# EAGLE design Combined MXP board (EAGLE 7.1.0)
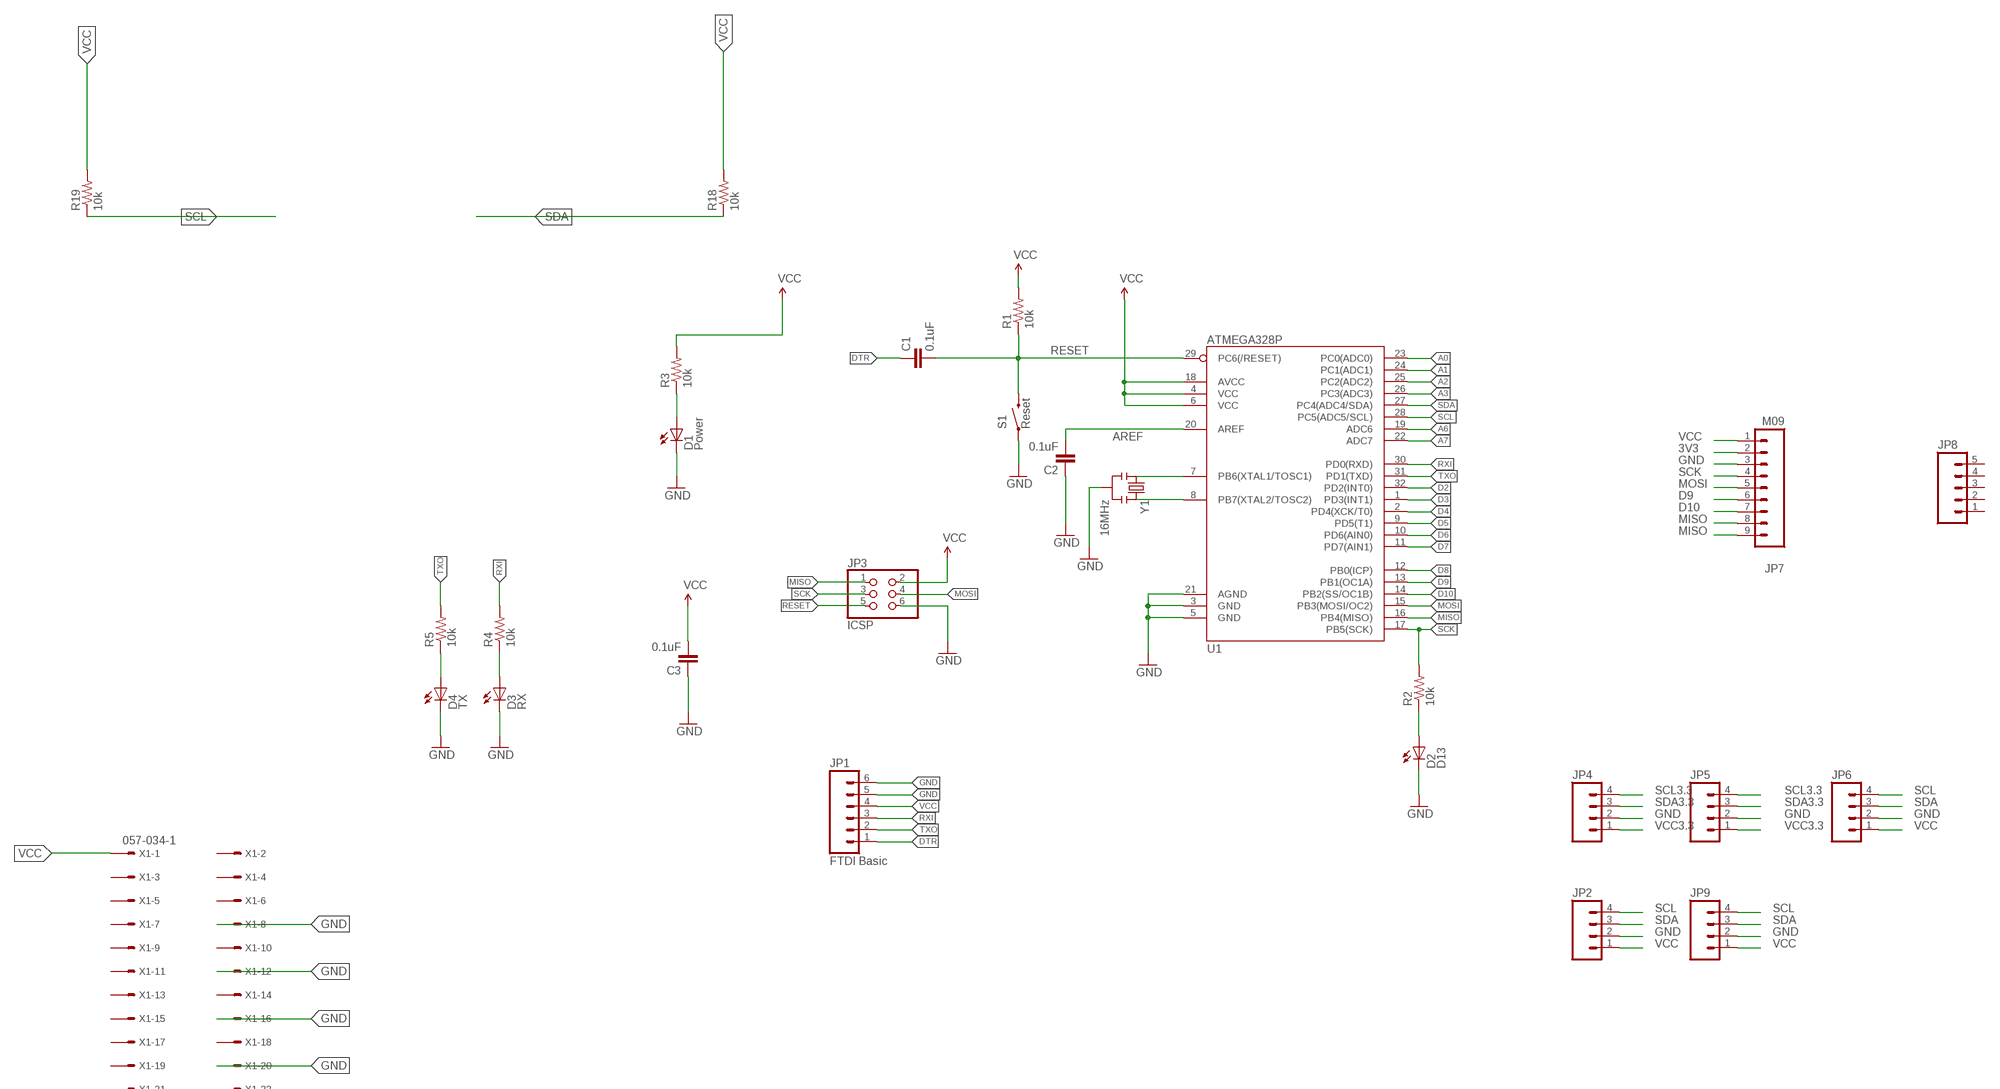
[diagram p0: schematic, sheet 1, part 1 of 2]
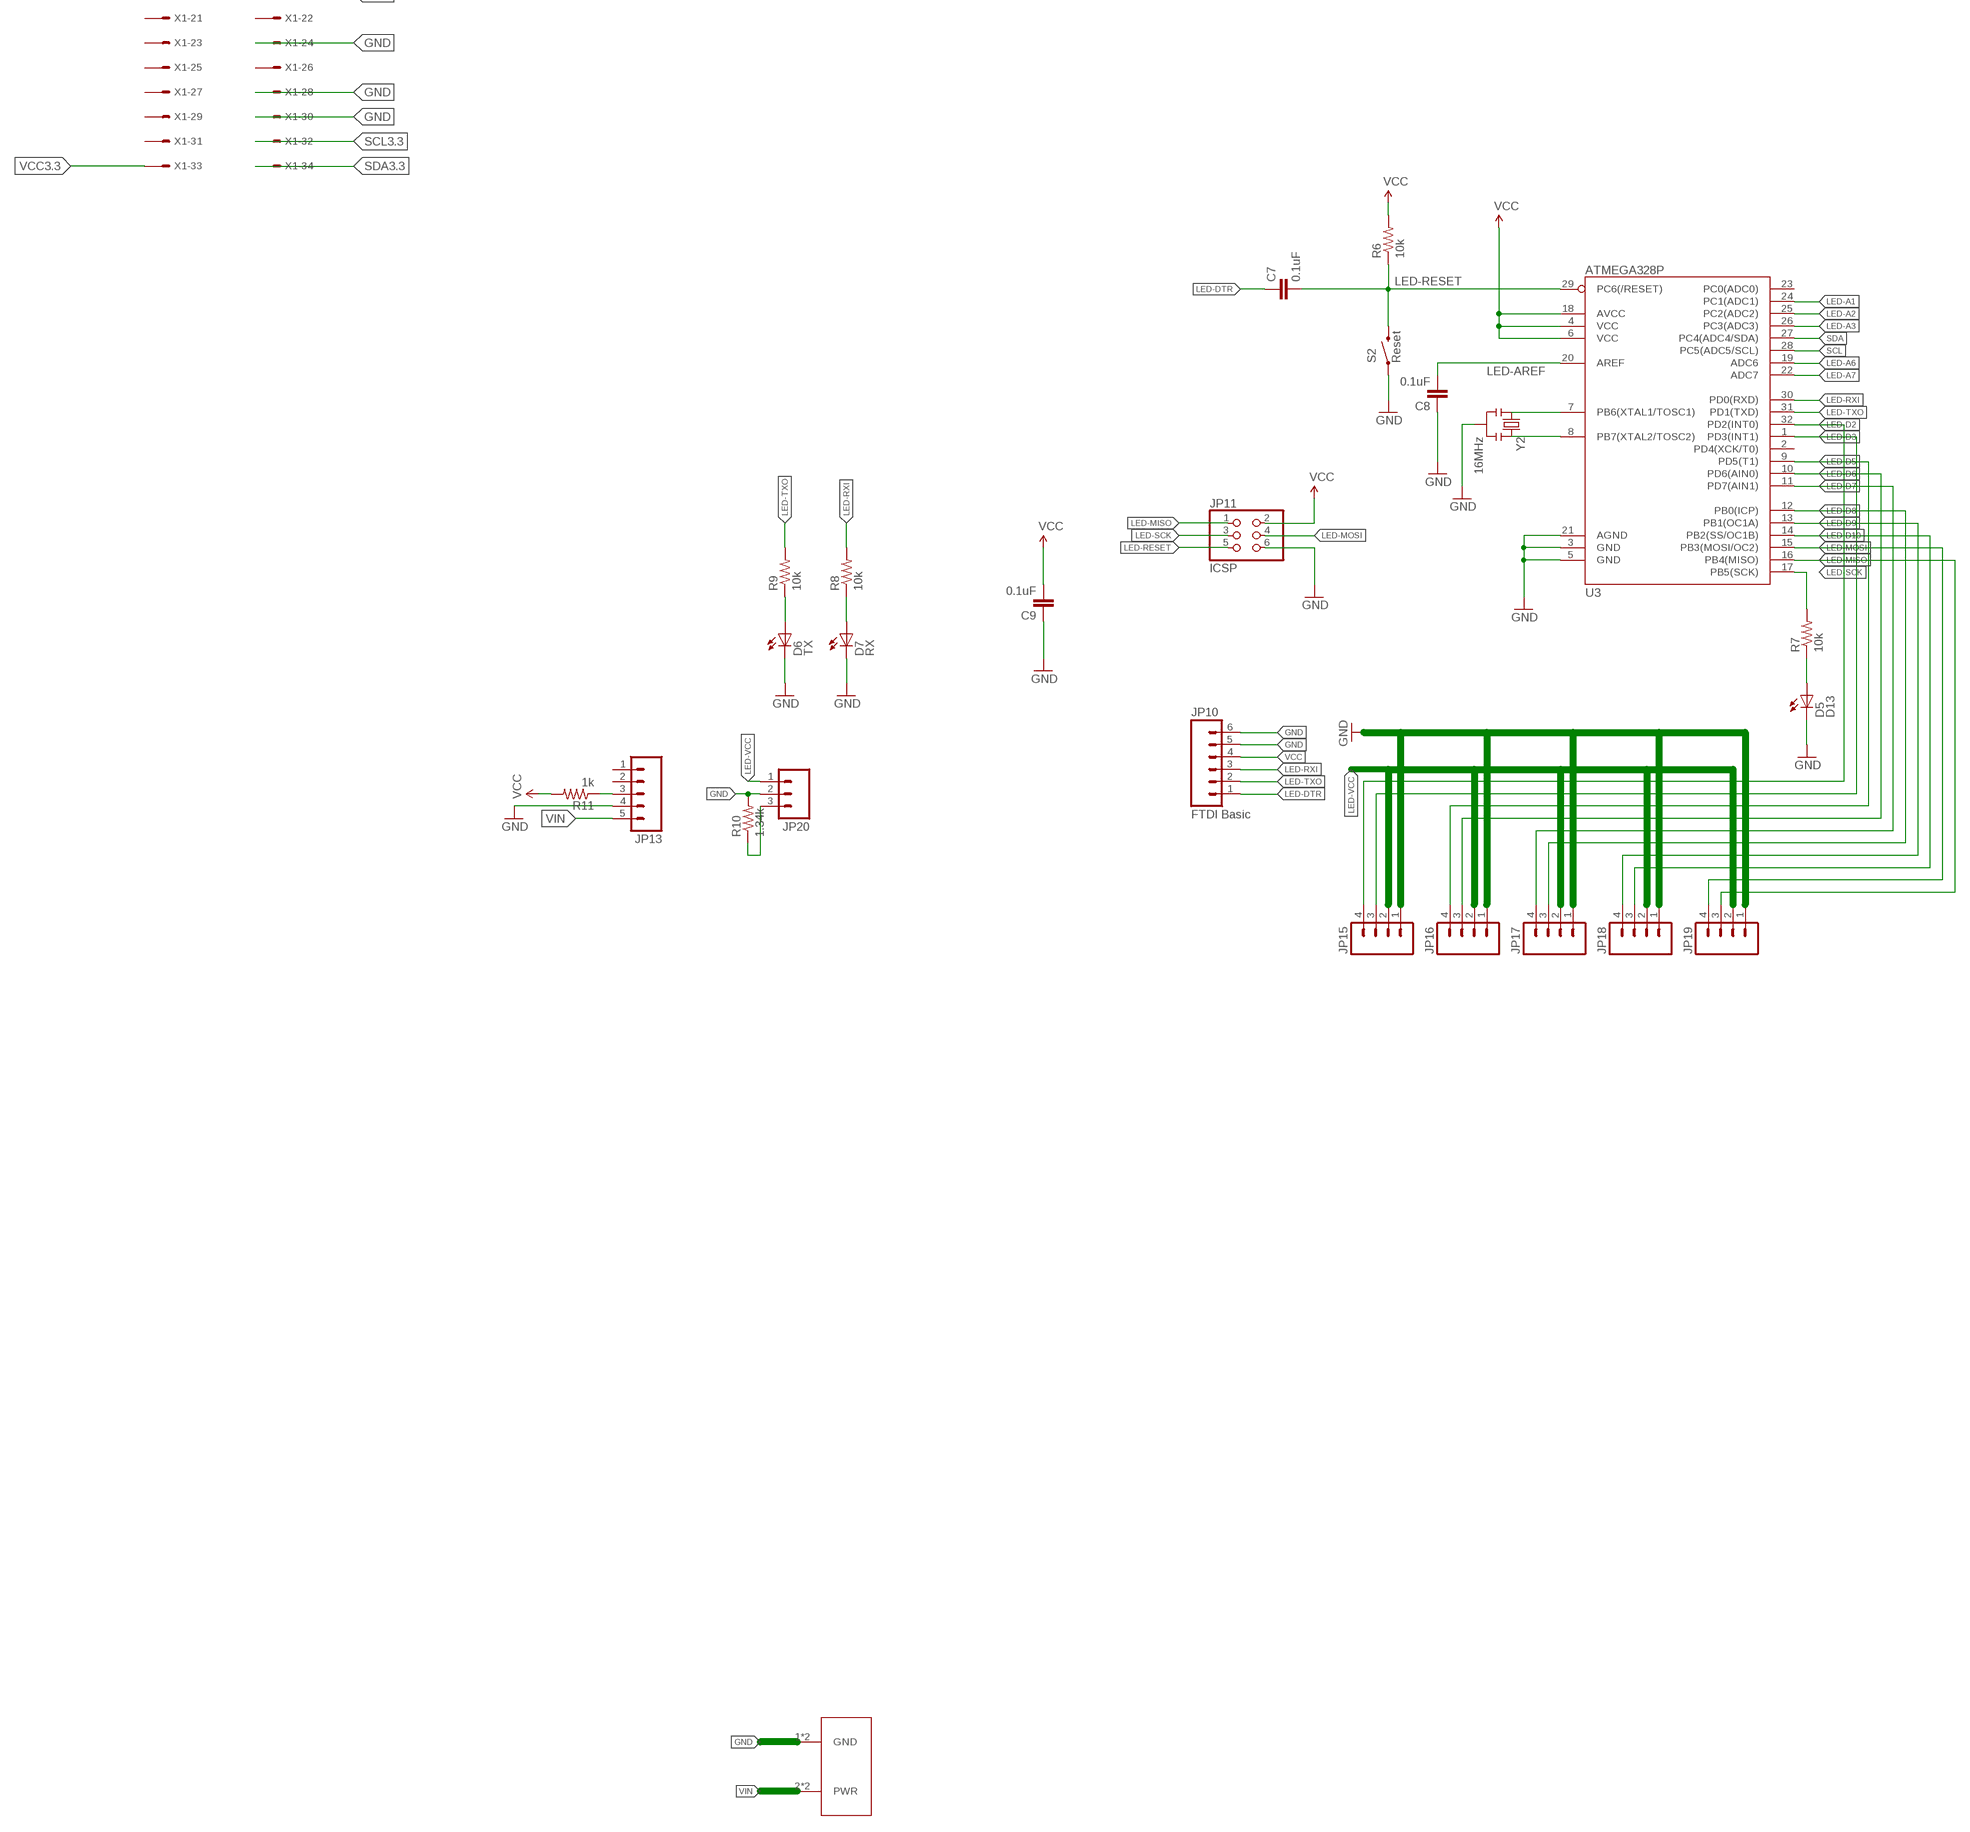
[diagram p1: schematic, sheet 1, part 2 of 2]

## Parts
C1  0.1uF  CAP0603-CAP  [0603-CAP]
C2  0.1uF  CAP0603-CAP  [0603-CAP]
C3  0.1uF  CAP0603-CAP  [0603-CAP]
C7  0.1uF  CAP0603-CAP  [0603-CAP]
C8  0.1uF  CAP0603-CAP  [0603-CAP]
C9  0.1uF  CAP0603-CAP  [0603-CAP]
D1  Power  LED-RED0603  [LED-0603]
D2  D13  LED-RED0603  [LED-0603]
D3  RX  LED-GREEN0603  [LED-0603]
D4  TX  LED-RED0603  [LED-0603]
D5  D13  LED-RED0603  [LED-0603]
D6  TX  LED-RED0603  [LED-0603]
D7  RX  LED-GREEN0603  [LED-0603]
JP1  FTDI Basic  M06SIP  [1X06]
JP2  M04PTH  [1X04]
JP3  ICSP  PINHD-2X3  [2X03]
JP4  M04PTH  [1X04]
JP5  M04PTH  [1X04]
JP6  M04PTH  [1X04]
JP7  M09  [1X09]
JP8  M05PTH  [1X05]
JP9  M04PTH  [1X04]
JP10  FTDI Basic  M06SIP  [1X06]
JP11  ICSP  PINHD-2X3  [2X03]
JP13  M05PTH  [1X05]
JP15  M04PTH  [1X04]
JP16  M04PTH  [1X04]
JP17  M04PTH  [1X04]
JP18  M04PTH  [1X04]
JP19  M04PTH  [1X04]
JP20  M03PTH  [1X03]
R1  10k  RESISTOR0603-RES  [0603-RES]
R2  10k  RESISTOR0603-RES  [0603-RES]
R3  10k  RESISTOR0603-RES  [0603-RES]
R4  10k  RESISTOR0603-RES  [0603-RES]
R5  10k  RESISTOR0603-RES  [0603-RES]
R6  10k  RESISTOR0603-RES  [0603-RES]
R7  10k  RESISTOR0603-RES  [0603-RES]
R8  10k  RESISTOR0603-RES  [0603-RES]
R9  10k  RESISTOR0603-RES  [0603-RES]
R10  1.34k  RESISTORAXIAL-0.3  [AXIAL-0.3]
R11  1k  RESISTORAXIAL-0.3  [AXIAL-0.3]
R18  10k  RESISTOR0603-RES  [0603-RES]
R19  10k  RESISTOR0603-RES  [0603-RES]
S1  Reset  SWITCH-MOMENTARY-2SMD  [TACTILE_SWITCH_SMD]
S2  Reset  SWITCH-MOMENTARY-2SMD  [TACTILE_SWITCH_SMD]
U1  ATMEGA328P  ATMEGA328_SMT  [TQFP32-08]
U3  ATMEGA328P  ATMEGA328_SMT  [TQFP32-08]
U$2  LSF-SMT  [LSF-SMT]
X1  057-034-1  [057-034-1]
Y1  16MHz  RESONATOR16MHZ  [RESONATOR-SMD]
Y2  16MHz  RESONATOR16MHZ  [RESONATOR-SMD]

## Nets
3V3: JP7.2
A0: U1.23(PC0(ADC0))
A1: U1.24(PC1(ADC1))
A2: U1.25(PC2(ADC2))
A3: U1.26(PC3(ADC3))
A6: U1.19(ADC6)
A7: U1.22(ADC7)
AREF: C2.2 U1.20(AREF)
D2: U1.32(PD2(INT0))
D3: U1.1(PD3(INT1))
D4: U1.2(PD4(XCK/T0))
D5: U1.9(PD5(T1))
D6: U1.10(PD6(AIN0))
D7: U1.11(PD7(AIN1))
D8: U1.12(PB0(ICP))
D9: JP7.6 U1.13(PB1(OC1A))
D10: JP7.7 U1.14(PB2(SS/OC1B))
DTR: C1.1 JP1.1
GND: C2.1 C3.1 C8.1 C9.1 D1.C D2.C D3.C D4.C D5.C D6.C D7.C JP1.5 JP1.6 JP2.2 JP3.6 JP4.2 JP5.2 JP6.2 JP7.3 JP9.2 JP10.5 JP10.6 JP11.6 JP13.4 JP15.1 JP16.1 JP17.1 JP18.1 JP19.1 JP20.2 R10.P$2 S1.1 S2.1 U1.3(GND) U1.5(GND) U1.21(AGND) U3.3(GND) U3.5(GND) U3.21(AGND) U$2.1(GND) U$2.1-2(GND) X1.8 X1.12 X1.16 X1.20 X1.24 X1.28 X1.30 Y1.2 Y2.2
LED-A1: U3.24(PC1(ADC1))
LED-A2: U3.25(PC2(ADC2))
LED-A3: U3.26(PC3(ADC3))
LED-A6: U3.19(ADC6)
LED-A7: U3.22(ADC7)
LED-AREF: C8.2 U3.20(AREF)
LED-D2: JP15.4 U3.32(PD2(INT0))
LED-D3: JP15.3 U3.1(PD3(INT1))
LED-D5: JP16.4 U3.9(PD5(T1))
LED-D6: JP16.3 U3.10(PD6(AIN0))
LED-D7: JP17.4 U3.11(PD7(AIN1))
LED-D8: JP17.3 U3.12(PB0(ICP))
LED-D9: JP18.4 U3.13(PB1(OC1A))
LED-D10: JP18.3 U3.14(PB2(SS/OC1B))
LED-DTR: C7.1 JP10.1
LED-MISO: JP11.1 JP19.3 U3.16(PB4(MISO))
LED-MOSI: JP11.4 JP19.4 U3.15(PB3(MOSI/OC2))
LED-RESET: C7.2 JP11.5 R6.1 S2.3 U3.29(PC6(/RESET))
LED-RXI: JP10.3 R8.2 U3.30(PD0(RXD))
LED-SCK: JP11.3 R7.2 U3.17(PB5(SCK))
LED-TXO: JP10.2 R9.2 U3.31(PD1(TXD))
LED-VCC: JP15.2 JP16.2 JP17.2 JP18.2 JP19.2 JP20.1
MISO: JP3.1 JP7.8 JP7.9 U1.16(PB4(MISO))
MOSI: JP3.4 JP7.5 U1.15(PB3(MOSI/OC2))
N$1: U1.7(PB6(XTAL1/TOSC1)) Y1.1
N$2: U1.8(PB7(XTAL2/TOSC2)) Y1.3
N$3: D1.A R3.1
N$4: D2.A R2.1
N$5: D3.A R4.1
N$6: D4.A R5.1
N$7: U3.7(PB6(XTAL1/TOSC1)) Y2.1
N$8: U3.8(PB7(XTAL2/TOSC2)) Y2.3
N$9: D5.A R7.1
N$10: D6.A R9.1
N$11: D7.A R8.1
N$12: JP20.3 R10.P$1
N$14: JP13.3 R11.P$1
RESET: C1.2 JP3.5 R1.1 S1.3 U1.29(PC6(/RESET))
RXI: JP1.3 R4.2 U1.30(PD0(RXD))
SCK: JP3.3 JP7.4 R2.2 U1.17(PB5(SCK))
SCL: JP2.4 JP6.4 JP9.4 R19.1 U1.28(PC5(ADC5/SCL)) U3.28(PC5(ADC5/SCL))
SCL3.3: JP4.4 JP5.4 X1.32
SDA: JP2.3 JP6.3 JP9.3 R18.1 U1.27(PC4(ADC4/SDA)) U3.27(PC4(ADC4/SDA))
SDA3.3: JP4.3 JP5.3 X1.34
TXO: JP1.2 R5.2 U1.31(PD1(TXD))
VCC: C3.2 C9.2 JP1.4 JP2.1 JP3.2 JP6.1 JP7.1 JP9.1 JP10.4 JP11.2 R1.2 R3.2 R6.2 R11.P$2 R18.2 R19.2 U1.4(VCC) U1.6(VCC) U1.18(AVCC) U3.4(VCC) U3.6(VCC) U3.18(AVCC) X1.1
VCC3.3: JP4.1 JP5.1 X1.33
VIN: JP13.5 U$2.2(PWR) U$2.2-2(PWR)
Unconnected: JP8.1 JP8.2 JP8.3 JP8.4 JP8.5 JP13.1 JP13.2 U3.2(PD4(XCK/T0)) U3.23(PC0(ADC0)) X1.2 X1.3 X1.4 X1.5 X1.6 X1.7 X1.9 X1.10 X1.11 X1.13 X1.14 X1.15 X1.17 X1.18 X1.19 X1.21 X1.22 X1.23 X1.25 X1.26 X1.27 X1.29 X1.31

## Library data of the parts
C1-C3 C7-C9 = SparkFun-Passives:CAP: Capacitor Standard 0603 ceramic capacitor, and 0.1" leaded capacitor.
D1 D2 D4-D6 = SparkFun-LED:LED-RED: Assorted Red LEDs LilyPad 1206- DIO-09912 1206- DIO-00809 0603- DIO-00819; PROD_ID: DIO-00819; VALUE: RED
D3 D7 = SparkFun-LED:LED-GREEN: Various green LEDs Green LEDs used in SFE Production 0603- DIO-00821 LARGE- DIO-00862 LILYPAD- DIO-09910; PROD_ID: DIO-00821; VALUE: GREEN
JP1 JP10 = SparkFun-Connectors:M06: Header 6 Standard 6-pin 0.1" header. Use with straight break away headers (SKU : PRT-00116), right angle break away headers (PRT-00553), swiss pins (PRT-00743), machine pins (PRT-00117), and female headers (PRT-00115). Molex polarized connector foot print use with SKU : PRT-08094 with associated crimp pins and housings. NOTES ON THE VARIANTS LOCK and LOCK_LONGPADS... This footprint was designed to help hold the alignment of a through-hole component (i.e. 6-pin header) while soldering it into place. You may notice that each hole has been shifted either up or down by 0.005 of an inch from it's more standard position (which is a perfectly straight line). This slight alteration caused the pins (the squares in the middle) to touch the edges of the holes. Because they are alternating, it causes a "brace" to hold the component in place. 0.005 has proven to be the perfect amount of "off-center" position when using our standard breakaway headers. Although looks a little odd when you look at the bare footprint, once you have a header in there, the alteration is very hard to notice. Also,if you push a header all the way into place, it is covered up entirely on the bottom side. This idea of altering the position of holes to aid alignment will be further integrated into the Sparkfun Library for other footprints. It can help hold any component with 3 or more connection pins.
JP2 JP4-JP6 JP9 JP15-JP19 = SparkFun-Connectors:M04: Header 4 Standard 4-pin 0.1" header. Use with straight break away headers (SKU : PRT-00116), right angle break away headers (PRT-00553), swiss pins (PRT-00743), machine pins (PRT-00117), and female headers (PRT-00115). Molex polarized connector foot print use with SKU : PRT-08231 with associated crimp pins and housings. 1MM SMD Version SKU: PRT-10208
JP3 JP11 = SparkFun-Connectors:PINHD-2X3: PIN HEADER
JP7 = SparkFun-Connectors:M09: Header 9 Standard 9-pin 0.1" header. Use with straight break away headers (SKU : PRT-00116), right angle break away headers (PRT-00553), swiss pins (PRT-00743), machine pins (PRT-00117), and female headers (PRT-00115).
JP8 JP13 = SparkFun-Connectors:M05: Header 5 Standard 5-pin 0.1" header. Use with straight break away headers (SKU : PRT-00116), right angle break away headers (PRT-00553), swiss pins (PRT-00743), machine pins (PRT-00117), and female headers (PRT-00115). Molex polarized connector foot print use with SKU : PRT-08230 with associated crimp pins and housings.
JP20 = SparkFun-Connectors:M03: Header 3 Standard 3-pin 0.1" header. Use with straight break away headers (SKU : PRT-00116), right angle break away headers (PRT-00553), swiss pins (PRT-00743), machine pins (PRT-00117), and female headers (PRT-00115). Molex polarized connector foot print use with SKU : PRT-08232 with associated crimp pins and housings.
R1-R9 R18 R19 = SparkFun-Passives:RESISTOR: Resistor Basic schematic elements and footprints for 0603, 1206, and PTH resistors.
R10 R11 = SparkFun-Resistors:RESISTOR: Resistor Basic schematic elements and footprints for 0603, 1206, and PTH resistors.
S1 S2 = SparkFun-Electromechanical:SWITCH-MOMENTARY-2: Various NO switches- pushbuttons, reed, etc; PROD_ID: SWCH-08247
U1 U3 = SparkFun-DigitalIC:ATMEGA328_SMT: 32-Pin Atmega328 part Commonly used on Arduino compatible boards Available in QFP and QFN packages TQFP is IC-09069 QFN is non-stock; PROD_ID: IC-09069
U$2 = LSF-SMT:LSF-SMT
X1 = con-panduit:057-034-: CONNECTOR 34-pin series 057 contact pc board low profile headers; OC_FARNELL: unknown; OC_NEWARK: unknown
Y1 Y2 = SparkFun-FreqCtrl:RESONATOR: Resonator Small SMD resonator. Used, eg, on the Arduino Pro/ Pro Mini boards. 8MHz- XTAL-08895 16MHz- XTAL-08900; PROD_ID: XTAL-08900

## Board
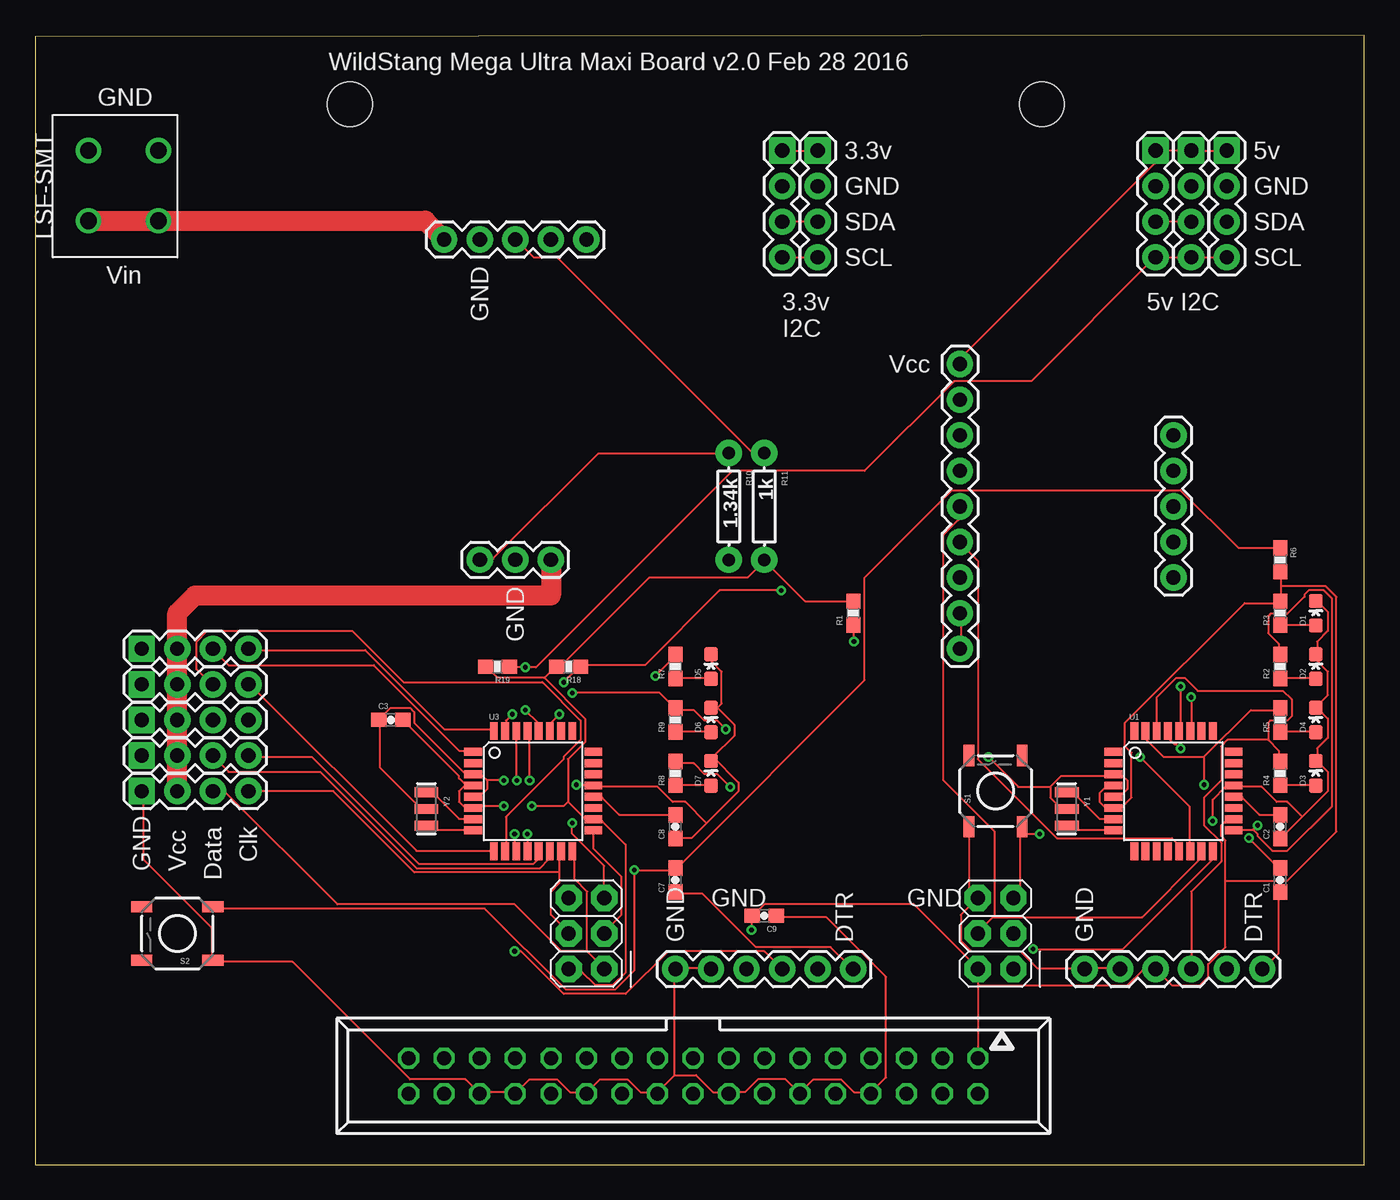
[diagram p2: board, top side]
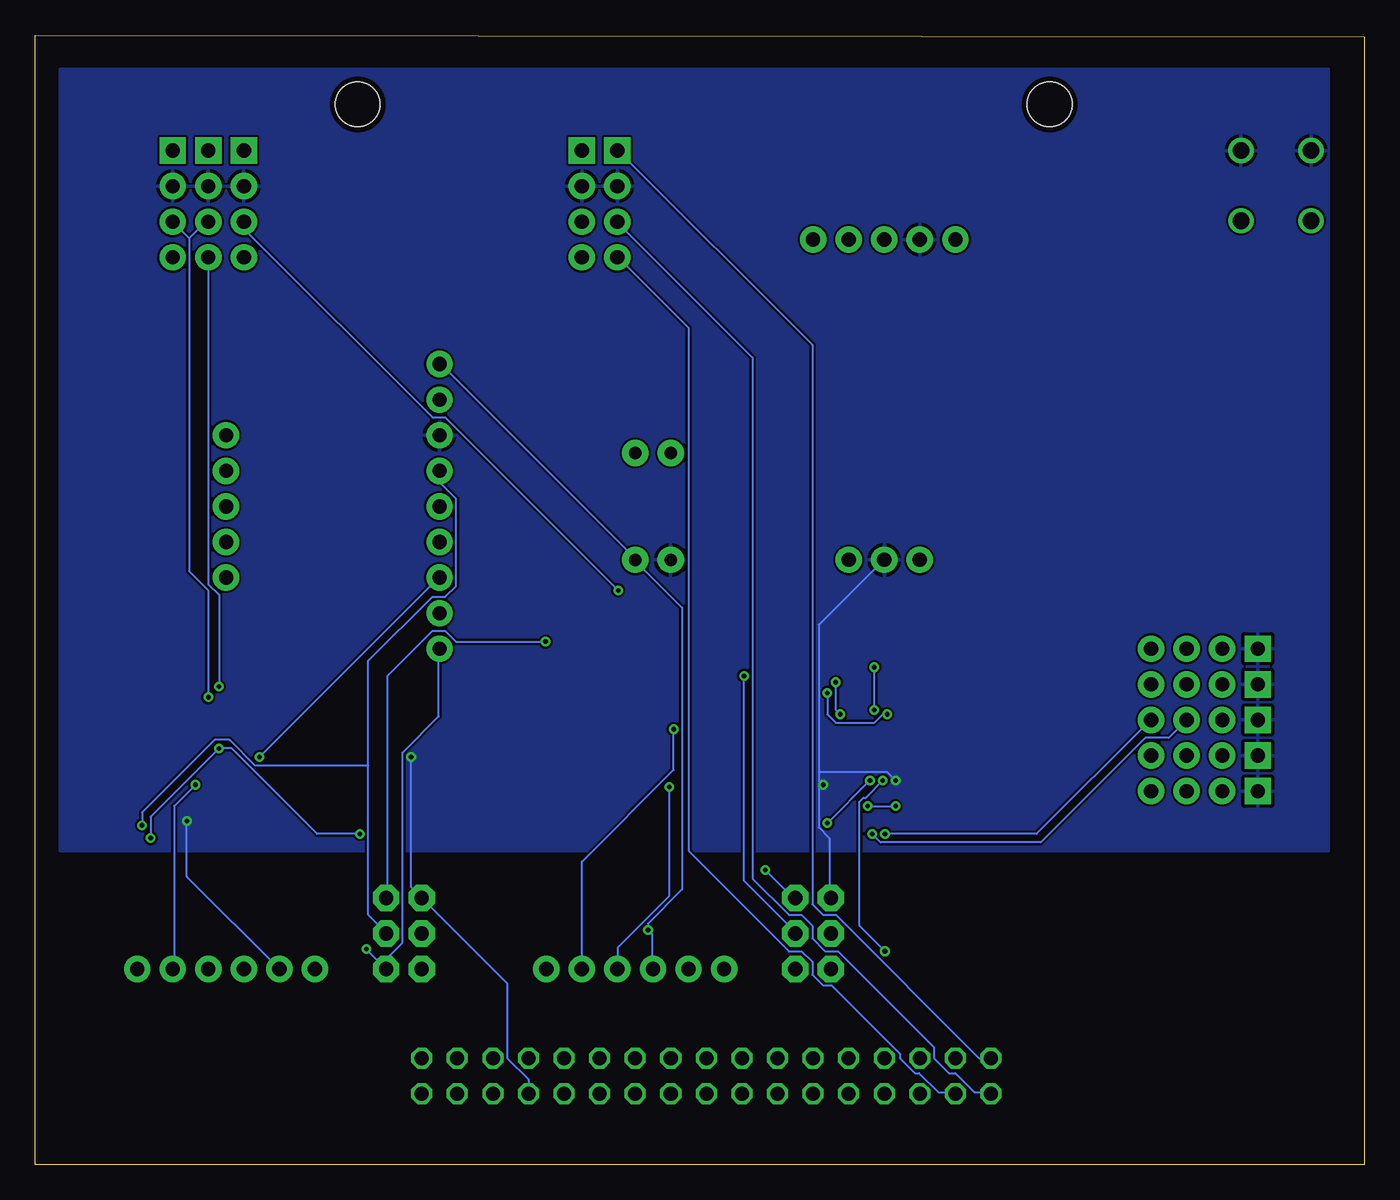
[diagram p3: board, bottom side, seen from below]

Size 94.92 x 80.64 mm. Coordinates in mm from the lower left corner, seen from the top.
Outline: 0,0 94.92,0 94.92,80.64 0,80.51 0,0
Copper layers (1*16): Top 0.0356mm / dielectric 1.5011mm / Bottom 0.0356mm
Design rules "LaenPCBOrder": minimum track width 6mil, minimum drill 13mil, track to track 6mil, track to pad 6mil, pad to pad 6mil, via to via 6mil, smd to smd 6mil, copper to edge 15mil, drill to drill 6mil, minimum pad ring 7mil, minimum via ring 7mil, stop-mask expansion 3mil, vias tented up to drill 0mil, thermal gap 10mil
Holes 3.2 mm at 22.48,75.69 71.88,75.69

### Footprints (pad centres in the part's own frame; a part is rotated, then mirrored left to right if it is on the bottom)
0603-CAP = smd 1.1 x 1: 1 -0.85,0; 2 0.85,0
LED-0603 = smd 1 x 1: A 0,-0.877; C 0,0.877
1X06 = drill 1.016 pad 1.88: 1 0,0; 2 2.54,0; 3 5.08,0; 4 7.62,0; 5 10.16,0; 6 12.7,0
1X04 = drill 1.016 pad 1.88 square: 1 0,0 | drill 1.016 pad 1.88: 2 2.54,0; 3 5.08,0; 4 7.62,0
2X03 = drill 1.016 pad 1.88 octagon: 1 -2.54,-1.27; 2 -2.54,1.27; 3 0,-1.27; 4 0,1.27; 5 2.54,-1.27; 6 2.54,1.27
1X09 = drill 1.016 pad 1.88: 1 0,0; 2 2.54,0; 3 5.08,0; 4 7.62,0; 5 10.16,0; 6 12.7,0; 7 15.24,0; 8 17.78,0; 9 20.32,0
1X05 = drill 1.016 pad 1.88: 1 0,0; 2 2.54,0; 3 5.08,0; 4 7.62,0; 5 10.16,0
1X03 = drill 1.016 pad 1.88: 1 0,0; 2 2.54,0; 3 5.08,0
0603-RES = smd 1.1 x 1: 1 -0.85,0; 2 0.85,0
AXIAL-0.3 = drill 0.9 pad 1.88: P$1 -3.81,0; P$2 3.81,0
TACTILE_SWITCH_SMD = smd 1.524 x 0.762: 1 -2.54,1.905; 2 2.54,1.905; 3 -2.54,-1.905; 4 2.54,-1.905
TQFP32-08 = smd 1.27 x 0.559: 1 -4.293,2.8; 2 -4.293,2; 3 -4.293,1.2; 4 -4.293,0.4; 5 -4.293,-0.4; 6 -4.293,-1.2; 7 -4.293,-2; 8 -4.293,-2.8; 17 4.293,-2.8; 18 4.293,-2; 19 4.293,-1.2; 20 4.293,-0.4; 21 4.293,0.4; 22 4.293,1.2; 23 4.293,2; 24 4.293,2.8 | smd 0.559 x 1.27: 9 -2.8,-4.293; 10 -2,-4.293; 11 -1.2,-4.293; 12 -0.4,-4.293; 13 0.4,-4.293; 14 1.2,-4.293; 15 2,-4.293; 16 2.8,-4.293; 25 2.8,4.293; 26 2,4.293; 27 1.2,4.293; 28 0.4,4.293; 29 -0.4,4.293; 30 -1.2,4.293; 31 -2,4.293; 32 -2.8,4.293
LSF-SMT = drill 1.199: 1 0,5.004; 1-2 0,0; 2 5.004,5.004; 2-2 5.004,0
057-034-1 = drill 1 octagon: 1 -20.32,-1.27; 2 -20.32,1.27; 3 -17.78,-1.27; 4 -17.78,1.27; 5 -15.24,-1.27; 6 -15.24,1.27; 7 -12.7,-1.27; 8 -12.7,1.27; 9 -10.16,-1.27; 10 -10.16,1.27; 11 -7.62,-1.27; 12 -7.62,1.27; 13 -5.08,-1.27; 14 -5.08,1.27; 15 -2.54,-1.27; 16 -2.54,1.27; 17 0,-1.27; 18 0,1.27; 19 2.54,-1.27; 20 2.54,1.27; 21 5.08,-1.27; 22 5.08,1.27; 23 7.62,-1.27; 24 7.62,1.27; 25 10.16,-1.27; 26 10.16,1.27; 27 12.7,-1.27; 28 12.7,1.27; 29 15.24,-1.27; 30 15.24,1.27; 31 17.78,-1.27; 32 17.78,1.27; 33 20.32,-1.27; 34 20.32,1.27
RESONATOR-SMD = smd 0.7 x 1.7: 1 -1.2,0; 2 0,0; 3 1.2,0

### Placement (x,y rotation side)
C1  88.9,20.32 90 top
C2  88.9,24.13 90 top
C3  25.4,31.75 0 top
C7  45.72,20.32 90 top
C8  45.72,24.13 90 top
C9  52.07,17.78 180 top
D1  91.44,39.37 0 top
D2  91.44,35.56 0 top
D3  91.44,27.94 0 top
D4  91.44,31.75 0 top
D5  48.26,35.56 0 top
D6  48.26,31.75 0 top
D7  48.26,27.94 0 top
JP1  87.63,13.97 180 top
JP2  80.01,72.39 270 top
JP3  68.58,16.51 90 top
JP4  55.88,72.39 270 top
JP5  53.34,72.39 270 top
JP6  85.09,72.39 270 top
JP7  66.04,57.15 270 top
JP8  81.28,52.07 270 top
JP9  82.55,72.39 270 top
JP10  58.42,13.97 180 top
JP11  39.37,16.51 90 top
JP13  39.37,66.04 180 top
JP15  7.62,36.83 0 top
JP16  7.62,34.29 0 top
JP17  7.62,31.75 0 top
JP18  7.62,29.21 0 top
JP19  7.62,26.67 0 top
JP20  36.83,43.18 180 top
R1  58.42,39.37 90 top
R2  88.9,35.56 90 top
R3  88.9,39.37 90 top
R4  88.9,27.94 90 top
R5  88.9,31.75 90 top
R6  88.9,43.18 270 top
R7  45.72,35.56 90 top
R8  45.72,27.94 90 top
R9  45.72,31.75 90 top
R10  49.53,46.99 270 top
R11  52.07,46.99 270 top
R18  38.1,35.56 180 top
R19  33.02,35.56 180 top
S1  68.58,26.67 90 top
S2  10.16,16.51 180 top
U1  81.28,26.67 0 top
U3  35.56,26.67 0 top
U$2  3.81,72.39 270 top
X1  46.99,6.35 180 top
Y1  73.66,25.4 270 top
Y2  27.94,25.4 270 top

### Tracks (layer width: path | path; a pad name or v marks a point on that pad's centre or on a via)
AREF
  Top 0.152: C2.2 88.8,24.99 87.43,24.99 86.21,26.21 85.6,26.21 U1.20
D9
  Top 0.152: U1.13 81.64,22.4 81.64,22.86 81.18,23.32 72.95,23.32 67.31,28.96 67.31,43.13 66.09,44.35 JP7.6
D10  (via drill 0.33)
  Top 0.152: v78.89,29.11 82.4,25.6 82.4,22.4 U1.14
  Bottom 0.152: v78.89,29.11 66.09,41.91 JP7.7
DTR
  Top 0.152: C1.1 88.8,19.36 88.8,15.09 87.73,14.02 JP1.1
GND  (via drill 0.33)
  Top 0.152: 48.41,29.11 49.94,30.63 49.94,31.39 48.72,32.61 | 48.41,29.11 48.26,28.96 D7.C 48.41,29.11 | 48.72,32.61 48.26,32.61 D6.C 48.72,32.61 | D5.C 48.26,35.97 49.02,35.2 49.02,32.92 48.72,32.61 | 47.95,24.38 50.24,26.67 50.24,27.28 48.41,29.11 | 47.95,24.38 46.89,23.32 45.82,23.32 C8.1 | 47.95,24.38 46.43,25.91 45.52,25.91 44.45,26.98 39.88,26.98 U3.21 39.73,27.13 v38.66,27.13 | 32.26,27.43 32.26,26.82 31.8,26.36 31.34,26.36 U3.5 | 32.26,27.43 31.95,27.74 31.34,27.74 U3.3 31.19,27.89 30.73,27.89 27.08,31.55 27.08,32.31 26.77,32.61 25.4,32.61 24.64,31.85 C3.1 24.64,31.7 24.64,28.35 27.53,25.45 27.84,25.45 Y2.2 | JP19.1 7.72,26.67 7.72,21.79 12.6,16.92 12.6,14.63 S2.1 12.75,14.48 18.39,14.48 26.77,6.1 30.73,6.1 X1.30 31.8,5.18 34.24,5.18 X1.28 35.31,6.1 37.29,6.1 38.2,5.18 39.27,5.18 X1.24 39.42,5.18 40.34,6.1 42.32,6.1 43.23,5.18 44.45,5.18 | v33.48,27.43 32.26,27.43 | 59.69,5.18 60.76,6.25 60.76,13.41 56.49,17.68 52.98,17.68 C9.1 | JP10.5 48.26,14.02 45.82,14.02 JP10.6 45.67,13.87 45.67,6.4 | 44.45,5.18 45.67,6.4 | 44.45,5.18 X1.20 | 45.67,6.4 47.19,6.4 48.41,5.18 49.48,5.18 X1.16 49.63,5.18 50.7,5.18 51.61,6.1 53.59,6.1 X1.12 54.66,5.18 55.58,6.1 57.56,6.1 58.47,5.18 59.69,5.18 | 59.69,5.18 X1.8 | D1.C 91.54,40.23 92.3,39.47 92.3,38.1 91.54,37.34 91.54,36.58 D2.C 91.54,36.42 91.54,35.97 92.3,35.2 92.3,33.53 91.54,32.77 D4.C 91.54,32.61 92.3,31.85 92.3,30.48 91.54,29.72 91.54,28.96 D3.C 91.54,28.8 92.3,28.04 92.3,26.67 90.48,24.84 | 90.48,24.84 88.95,23.32 C2.1 | 90.48,24.84 89.41,25.91 88.65,25.91 87.58,26.98 85.6,26.98 U1.21 85.45,26.98 84.99,26.98 84.07,26.06 v84.07,24.54
  Top 0.152: 74.93,14.02 77.37,14.02 JP1.5 | U1.5 77.06,26.36 77.52,26.36 77.98,26.82 77.98,27.43 77.67,27.74 77.06,27.74 U1.3 76.91,27.74 73.25,27.74 72.49,26.98 | 72.49,26.98 72.49,26.21 73.25,25.45 73.56,25.45 Y1.2 | S1.1 66.7,24.08 66.7,19.66 JP3.6 66.09,17.83 66.09,16 66.85,15.24 70.36,15.24 71.58,14.02 74.93,14.02 | 72.49,26.98 70.21,26.98 v68.07,29.11 | 74.93,14.02 JP1.6
  Bottom 0.152: 38.96,28.04 38.96,38.56 34.39,43.13 JP20.2 | 38.96,28.04 38.96,27.13 | 38.96,27.13 38.96,24.08 38.2,23.32 38.2,19.05 JP11.6 | v33.48,27.43 34.09,28.04 38.96,28.04 | 38.96,27.13 v38.66,27.13 | v68.07,29.11 68.07,19.81 JP3.6 61.21,12.95 61.21,7.62 59.69,6.1 X1.8 | v84.07,24.54 84.07,20.57 JP1.5
  pour Bottom: 2.59,78.18 93.12,78.18 93.12,22.4 2.59,22.4
LED-AREF
  Top 0.152: C8.2 45.67,24.99 41.71,24.99 40.49,26.21 39.88,26.21 U3.20
LED-D2
  Top 0.152: U3.32 32.72,31.09 29.21,31.09 23.57,36.73 15.34,36.73 JP15.4
LED-D3
  Top 0.152: U3.1 31.19,29.57 30.28,29.57 24.18,35.66 13.82,35.66 12.75,36.73 JP15.3
LED-D5
  Top 0.152: U3.9 32.72,22.4 27.23,22.4 15.34,34.29 JP16.4
LED-D6
  Top 0.152: U3.10 33.63,22.4 33.63,24.84 37.74,28.96 37.74,29.11 38.96,30.33 38.96,31.7 36.22,34.44 26.31,34.44 22.66,38.1 12.29,38.1 11.53,37.34 11.53,35.36 12.6,34.29 JP16.3
LED-D7  (via drill 0.33)
  Top 0.152: v34.24,23.62 34.24,22.4 U3.11
  Bottom 0.152: v34.24,23.62 23.42,23.62 15.34,31.7 JP17.4
LED-D8  (via drill 0.33)
  Top 0.152: v35.15,23.62 35.15,22.4 U3.12
  Bottom 0.152: v35.15,23.62 34.54,23.01 23.11,23.01 15.65,30.48 13.97,30.48 JP17.3
LED-D9
  Top 0.152: U3.13 35.92,22.25 35.92,21.79 35.61,21.49 27.38,21.49 19.76,29.11 15.34,29.11 JP18.4
LED-D10
  Top 0.152: U3.14 36.68,22.25 36.68,21.79 36.07,21.18 27.23,21.18 20.37,28.04 13.82,28.04 12.75,29.11 JP18.3
LED-DTR
  Top 0.152: C7.1 45.82,19.36 47.65,19.36 51.46,15.54 56.79,15.54 58.32,14.02 JP10.1
LED-MISO
  Top 0.152: 39.42,15.24 39.42,19.51 38.51,20.42 38.51,22.25 U3.16 | 39.42,15.24 40.64,14.02 JP11.1 | JP19.3 13.51,26.67 21.59,18.59 34.24,18.59 37.59,15.24 39.42,15.24
LED-MOSI
  Top 0.152: 37.44,20.88 37.44,20.12 36.83,19.51 36.83,17.83 38.05,16.61 JP11.4 | 37.44,20.88 37.44,22.25 U3.15 | JP19.4 21.28,26.67 27.08,20.88 37.44,20.88
LED-RESET  (via drill 0.33)
  Top 0.152: R6.1 88.8,44.04 85.9,44.04 81.79,48.16 65.48,48.16 59.23,41.91 59.23,34.59 45.82,21.18 C7.2 45.67,21.03 v42.77,21.03 42.77,13.87 41.4,12.5 37.9,12.5 32.11,18.29 12.75,18.29 S2.3 | v35.31,27.43 35.31,30.94 U3.29 | v38.35,24.38 38.35,23.62 40.64,21.34 JP11.5
  Bottom 0.152: v42.77,21.03 40.79,19.05 JP11.5 | v38.35,24.38 v35.31,27.43
LED-RXI  (via drill 0.33)
  Top 0.152: v49.63,26.98 48.72,27.89 47.8,27.89 47.04,28.65 45.82,28.65 R8.2 | v34.39,27.43 34.39,30.94 U3.30 | v34.24,15.24 34.7,15.24 37.74,12.19 42.16,12.19 45.21,15.24 52.07,15.24 JP10.3
  Bottom 0.152: v49.63,26.98 49.63,19.2 53.29,15.54 53.29,14.02 JP10.3 | v34.39,27.43 35.61,26.21 35.76,26.21 36.07,25.91 36.07,17.07 v34.24,15.24
LED-SCK  (via drill 0.33)
  Top 0.152: v44.3,34.9 45.67,36.27 R7.2 | U3.17 39.88,23.77 39.88,22.55 41.86,20.57 41.86,17.83 40.64,16.61 JP11.3
  Bottom 0.152: v44.3,34.9 44.3,20.27 40.64,16.61 JP11.3
LED-TXO  (via drill 0.33)
  Top 0.152: v49.33,31.09 48.72,31.7 47.8,31.7 47.04,32.46 45.82,32.46 R9.2 45.67,32.61 44.6,33.68 v38.35,33.68 | v34.09,32.16 33.63,31.7 33.63,31.09 U3.31
  Bottom 0.152: v49.33,31.09 49.33,28.19 55.88,21.64 JP10.2 | v34.09,32.16 34.39,32.16 35,31.55 37.74,31.55 38.35,32.16 v38.35,33.68
LED-VCC
  Top 1.422: JP19.2 JP18.2 10.16,29.26 JP17.2 10.16,31.85 JP16.2 JP15.2 10.16,39.37 11.43,40.64 36.83,40.64 JP20.1
MISO  (via drill 0.33)
  Top 0.152: JP7.9 66.09,36.88 66.09,39.32 JP7.8 | v71.27,15.39 77.67,15.39 84.07,21.79 84.07,22.25 U1.16
  Bottom 0.152: 70.21,14.33 JP3.1 69.9,14.02 | 70.21,14.33 v71.27,15.39 | 70.21,14.33 68.68,15.85 68.68,29.41 66.09,32 66.09,36.73 JP7.9
MOSI
  Top 0.152: 68.53,17.68 68.38,17.68 67.31,16.61 JP3.4 | 68.53,17.68 79.05,17.68 83.16,21.79 83.16,22.25 U1.15 | 68.53,17.68 68.53,23.77 64.87,27.43 64.87,44.96 65.94,46.02 65.94,46.94 JP7.5
N$1
  Top 0.152: U1.7 76.91,24.69 76,24.69 74.17,26.52 73.71,26.52 Y1.1
N$2
  Top 0.152: U1.8 76.91,23.93 73.86,23.93 73.71,24.08 Y1.3
N$3
  Top 0.152: D1.A 91.39,38.56 88.95,38.56 R3.1
N$4
  Top 0.152: D2.A 91.39,34.75 88.95,34.75 R2.1
N$5
  Top 0.152: D3.A 91.39,27.13 88.95,27.13 R4.1
N$6
  Top 0.152: D4.A 91.39,30.94 88.95,30.94 R5.1
N$7
  Top 0.152: U3.7 31.19,24.69 30.28,24.69 28.45,26.52 27.99,26.52 Y2.1
N$8
  Top 0.152: U3.8 31.19,23.93 28.14,23.93 27.99,24.08 Y2.3
N$9
  Top 0.152: D5.A 48.26,34.75 45.82,34.75 R7.1
N$10
  Top 0.152: D6.A 48.26,30.94 45.82,30.94 R9.1
N$11
  Top 0.152: D7.A 48.26,27.13 45.82,27.13 R8.1
N$12
  Top 0.152: JP20.3 31.8,43.28 32.72,43.28 40.18,50.75 49.48,50.75 R10.P$1
N$14
  Top 0.152: R11.P$1 52.07,50.9 51.16,50.9 37.29,64.77 35.61,64.77 34.39,65.99 JP13.3
RESET  (via drill 0.33)
  Top 0.152: v86.67,23.32 88.8,21.18 C1.2 | v81.79,29.72 81.48,30.02 81.33,30.02 81.03,30.33 81.03,30.94 U1.29 | v58.47,37.34 58.47,38.41 R1.1 | 70.36,23.62 70.36,19.51 69.9,19.05 JP3.5 | 70.36,23.62 70.36,24.08 S1.3 70.36,23.62 | 70.36,23.62 v71.73,23.62
  Bottom 0.152: v86.67,23.32 86.67,24.84 v81.79,29.72 80.87,29.72 74.78,23.62 v71.73,23.62 | v58.47,37.34 64.87,37.34 65.63,38.1 66.55,38.1 69.75,34.9 69.75,19.05 JP3.5
RXI
  Top 0.152: 88.04,30.33 88.8,29.57 88.8,28.8 R4.2 | 88.04,30.33 88.04,31.55 88.19,31.7 89.41,31.7 89.71,32 89.71,33.22 89.1,33.83 83.01,33.83 82.09,34.75 81.48,34.75 80.11,33.38 80.11,31.09 U1.30 | JP1.3 82.55,19.51 84.68,21.64 84.68,23.01 83.46,24.23 83.46,26.21 84.68,27.43 84.68,29.87 85.14,30.33 88.04,30.33
SCK  (via drill 0.33)
  Top 0.152: 86.97,23.93 87.27,23.62 87.27,23.47 88.34,22.4 89.41,22.4 92.61,25.6 92.61,40.39 92,41 90.93,41 90.63,40.69 90.63,40.54 89.41,39.32 88.19,39.32 88.04,39.17 88.04,37.95 88.8,37.19 88.8,36.42 R2.2 | 86.97,23.93 85.6,23.93 U1.17 | v87.27,24.23 86.97,23.93
  Bottom 0.152: 71.12,28.5 71.12,17.83 69.9,16.61 JP3.3 | 71.12,28.5 71.12,35.97 66.55,40.54 65.63,40.54 64.87,41.3 64.87,47.55 65.94,48.62 65.94,49.53 JP7.4 | v87.27,24.23 87.27,25.15 82.09,30.33 81.03,30.33 79.2,28.5 71.12,28.5
SCL  (via drill 0.33)
  Top 0.152: v81.79,34.14 81.79,31.09 U1.28 | JP6.4 JP9.4 JP2.4 79.96,64.77 71.12,55.93 65.63,55.93 59.23,49.53 49.78,49.53 35.76,35.51 v35,35.51 33.93,35.51 R19.1 | v35,32.46 35.92,31.55 35.92,31.09 U3.28
  Bottom 0.152: v81.79,34.14 81.79,40.69 82.55,41.45 JP9.4 | v35,32.46 v35,35.51
SCL3.3
  Top 0.152: JP5.4 JP4.4
  Bottom 0.152: X1.32 29.21,5.18 30.43,5.18 31.8,6.55 32.11,6.55 33.17,7.62 33.17,7.92 38.05,12.8 38.66,12.8 39.42,13.56 39.42,14.48 40.18,15.24 41.1,15.24 48.26,22.4 48.26,59.74 53.29,64.77 JP5.4
SDA  (via drill 0.33)
  Top 0.152: v82.55,33.38 82.55,31.09 U1.27 | v37.74,34.44 38.81,35.51 R18.1 38.96,35.66 43.54,35.66 48.87,41 v53.29,41 | v37.44,32.16 36.83,31.55 36.83,31.09 U3.27 | JP9.3 82.55,67.36 80.11,67.36 JP2.3
  Bottom 0.152: v82.55,33.38 82.55,41 83.92,42.37 83.92,66.14 | JP6.3 83.92,66.14 | 83.92,66.14 82.86,67.21 82.55,67.21 JP9.3 | v37.74,34.44 37.74,32.46 v37.44,32.16 | v53.29,41 65.63,53.34 66.55,53.34 79.96,66.75 79.96,67.21 JP2.3
SDA3.3
  Top 0.152: JP4.3 55.88,67.36 53.44,67.36 JP5.3
  Bottom 0.152: X1.34 26.77,5.18 27.84,5.18 29.21,6.55 29.67,6.55 30.73,7.62 30.73,8.38 37.59,15.24 38.51,15.24 39.42,16.15 39.42,17.07 40.18,17.83 41.1,17.83 43.69,20.42 43.69,57.61 53.29,67.21 JP5.3
TXO  (via drill 0.33)
  Top 0.152: 83.46,29.11 86.82,32.46 88.8,32.46 R5.2 | 83.46,29.11 80.57,29.11 79.35,30.33 79.35,30.94 U1.31 | 83.46,29.11 v83.46,27.13
  Bottom 0.152: v83.46,27.13 84.99,25.6 84.99,14.02 JP1.2
VCC  (via drill 0.33)
  Top 0.152: 88.95,41.3 88.95,42.22 R6.2 | 88.95,41.3 88.95,40.23 R3.2 88.8,40.08 86.36,40.08 77.83,31.55 77.83,29.87 78.28,29.41 78.28,26.21 77.67,25.6 77.06,25.6 U1.6 76.91,25.6 76.3,25.6 76,25.91 76,26.52 76.45,26.98 76.91,26.98 U1.4 | 84.99,20.27 84.99,15.54 83.77,14.33 83.77,13.41 83.16,12.8 81.18,12.8 JP1.4 79.96,13.87 79.05,13.87 77.98,12.8 67.31,12.8 | 84.99,20.27 84.99,23.16 84.68,23.47 84.68,24.23 84.99,24.54 85.45,24.54 U1.18 | 67.31,12.8 JP3.2 67.31,14.02 62.74,18.59 52.07,18.59 51.31,17.83 C9.2 51.16,17.68 v51.16,16.76 | 67.31,12.8 X1.1 | 88.95,41.3 92.15,41.3 92.91,40.54 92.91,23.77 89.41,20.27 84.99,20.27 | 30.73,27.13 30.28,27.58 30.28,27.74 26.31,31.7 C3.2 | 30.73,27.13 31.19,27.13 U3.4 30.73,27.13 | 30.73,27.13 30.28,26.67 30.28,25.91 30.58,25.6 31.19,25.6 U3.6 31.34,25.6 v33.48,25.6 | 36.37,34.75 33.02,34.75 32.26,35.51 R19.2 | 36.37,34.75 37.14,35.51 R18.2 37.29,35.66 37.59,35.66 43.84,41.91 50.85,41.91 52.07,43.13 | 38.05,25.91 39.27,24.69 39.73,24.69 U3.18 39.88,24.54 40.49,24.54 42.16,22.86 42.16,13.72 41.25,12.8 40.03,12.8 38.96,13.87 38.2,13.87 JP11.2 | 38.05,25.91 38.05,28.96 39.27,30.18 39.27,31.85 36.37,34.75 | v35.46,25.6 37.74,25.6 38.05,25.91 | JP6.1 JP9.1 JP2.1 79.96,72.39 79.96,71.48 66.09,57.61 66.09,57.15 JP7.1 | 52.07,43.13 54.97,40.23 58.32,40.23 R1.2 | 52.07,43.13 R11.P$2
  Bottom 0.152: JP10.4 50.85,14.02 50.85,16.46 v51.16,16.76 51.16,17.22 48.72,19.66 48.72,39.78 52.07,43.13 R11.P$2 52.07,43.28 65.94,57.15 JP7.1 | v35.46,25.6 v33.48,25.6
VCC3.3
  Top 0.152: JP5.1 JP4.1
  Bottom 0.152: X1.33 27.53,7.62 37.74,17.83 38.66,17.83 39.42,18.59 39.42,58.52 53.29,72.39 JP5.1
VIN
  Top 1.422: U$2.2-2 U$2.2 27.86,67.39 JP13.5

### Text on the board
tPlace: WildStang Mega Ultra Maxi Board v2.0 Feb 28 2016 | GND | 3.3v | 5v | GND | GND | SDA | SDA | GND | SCL | SCL | Vin | 5v I2C | 3.3v / I2C | Vcc | GND | Clk | GND | Vcc | Data | GND | GND | GND | DTR | GND | DTR